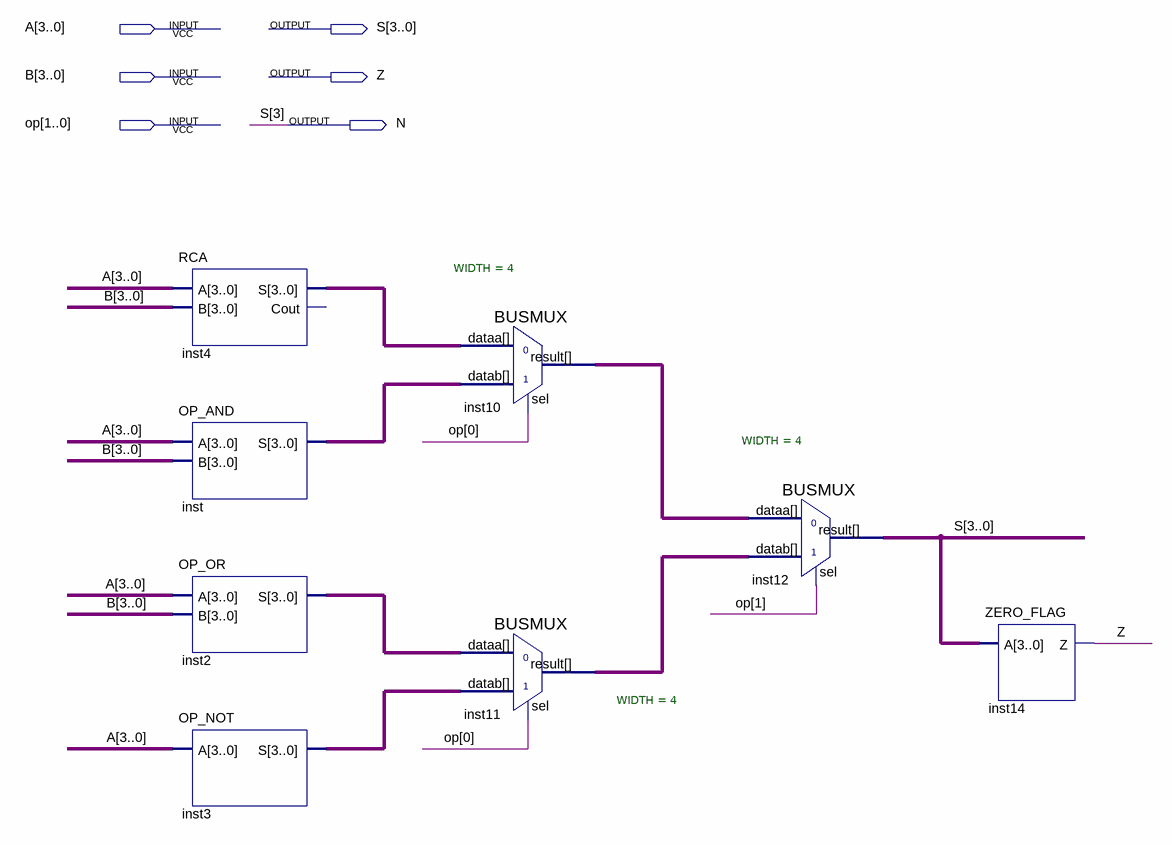
[diagram p0: schematic sheet]
// Quartus schematic ULA.bdf as structural Verilog: 8 symbols, 6 pins
module ULA (
  input  [3:0] A,
  input  [3:0] B,
  input  [1:0] op,
  output [3:0] S,
  output Z,
  output N
);

  wire [3:0] inst2_s, inst3_s, inst4_s, inst10_result, inst11_result, inst_s;

  RCA inst4 (.A(A), .B(B), .S(inst4_s));  // open: Cout
  OP_AND inst (.A(A), .B(B), .S(inst_s));
  OP_OR inst2 (.A(A), .B(B), .S(inst2_s));
  OP_NOT inst3 (.A(A), .S(inst3_s));
  BUSMUX #(.WIDTH(4)) inst10 (.datab(inst_s), .sel(op[0]), .dataa(inst4_s), .result(inst10_result));
  BUSMUX #(.WIDTH(4)) inst11 (.datab(inst3_s), .sel(op[0]), .dataa(inst2_s), .result(inst11_result));
  BUSMUX #(.WIDTH(4)) inst12 (.datab(inst11_result), .sel(op[1]), .dataa(inst10_result), .result({N, S[2:0]}));
  ZERO_FLAG inst14 (.A({N, S[2:0]}), .Z(Z));

  assign S[3] = N;
endmodule
